# EAGLE design Pickini4 (EAGLE 5.11)
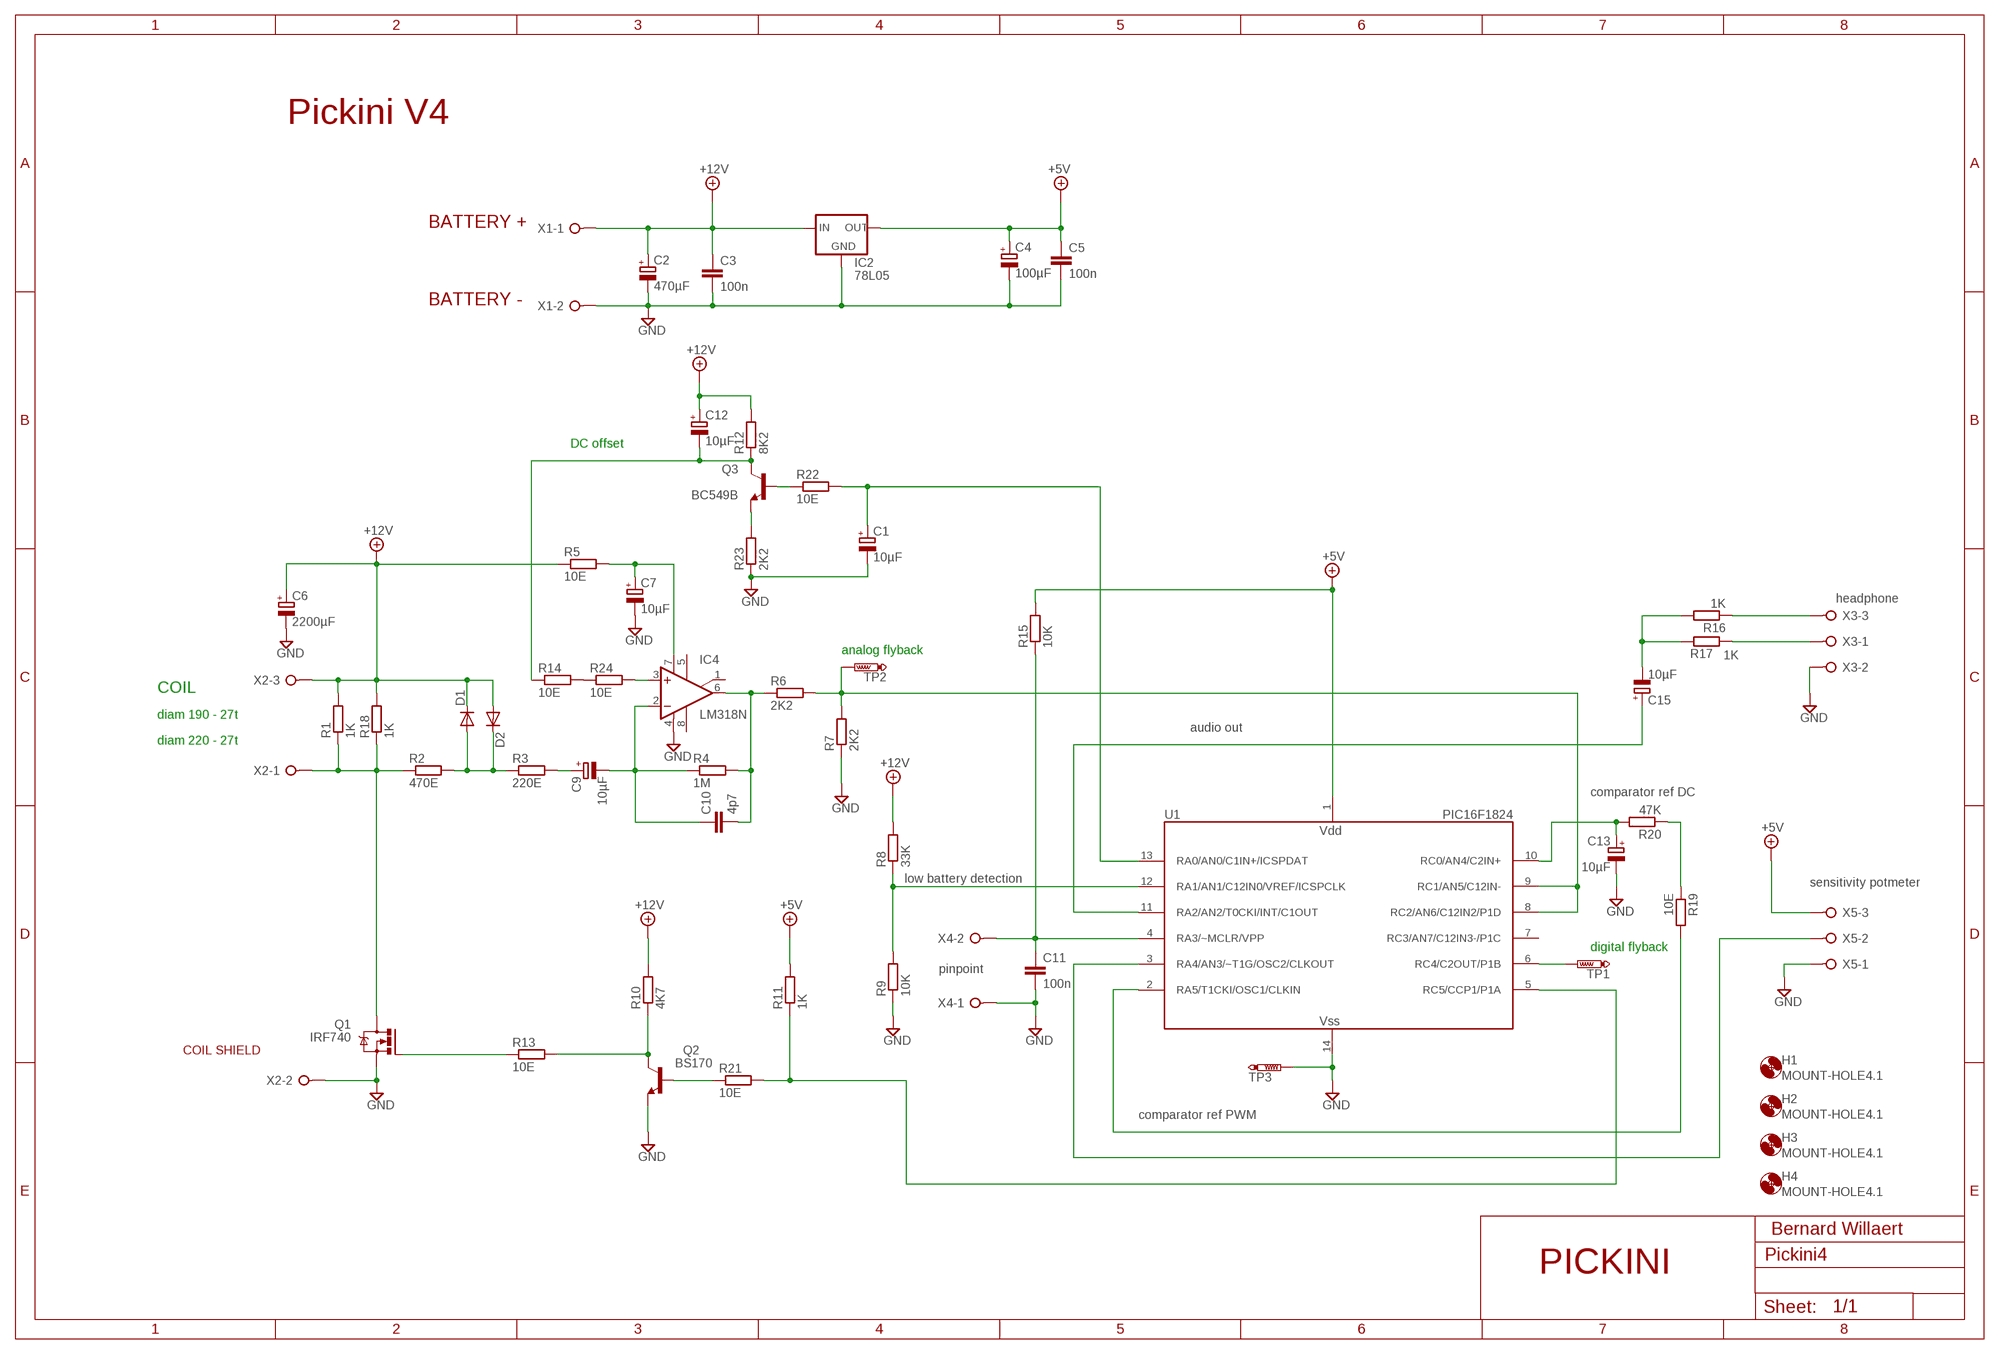
[diagram p0: schematic, sheet 1]

## Parts
C1  10µF  CPOL-EUE5-6  [E5-6]
C2  470µF  CPOL-EUE5-6  [E5-6]
C3  100n  C-EU050-025X075  [C050-025X075]
C4  100µF  CPOL-EUE5-6  [E5-6]
C5  100n  C-EU050-025X075  [C050-025X075]
C6  2200µF  CPOL-EUE7.5-16  [E7,5-16]
C7  10µF  CPOL-EUE5-6  [E5-6]
C9  10µF  CPOL-EUE5-6  [E5-6]
C10  4p7  C-EU050-025X075  [C050-025X075]
C11  100n  C-EU050-025X075  [C050-025X075]
C12  10µF  CPOL-EUE5-6  [E5-6]
C13  10µF  CPOL-EUE5-6  [E5-6]
C15  10µF  CPOL-EUE5-6  [E5-6]
D1  1N4148DO35-7  [DO35-7]
D2  1N4148DO35-7  [DO35-7]
H1  MOUNT-HOLE4.1  [4,1]
H2  MOUNT-HOLE4.1  [4,1]
H3  MOUNT-HOLE4.1  [4,1]
H4  MOUNT-HOLE4.1  [4,1]
IC2  78L05  78LXX  [78LXX]
IC4  LM318N  [DIL08]
Q1  IRF740  [TO220BV]
Q2  BS170  BC549-NPN-TO92-CBE  [TO92-CBE]
Q3  BC549B  [TO92-EBC]
R1  1K  R-EU_0207/10  [0207/10]
R2  470E  R-EU_0207/10  [0207/10]
R3  220E  R-EU_0207/10  [0207/10]
R4  1M  R-EU_0207/10  [0207/10]
R5  10E  R-EU_0207/10  [0207/10]
R6  2K2  R-EU_0207/10  [0207/10]
R7  2K2  R-EU_0207/10  [0207/10]
R8  33K  R-EU_0207/10  [0207/10]
R9  10K  R-EU_0207/10  [0207/10]
R10  4K7  R-EU_0207/10  [0207/10]
R11  1K  R-EU_0207/10  [0207/10]
R12  8K2  R-EU_0207/10  [0207/10]
R13  10E  R-EU_0207/10  [0207/10]
R14  10E  R-EU_0207/10  [0207/10]
R15  10K  R-EU_0207/10  [0207/10]
R16  1K  R-EU_0207/10  [0207/10]
R17  1K  R-EU_0207/10  [0207/10]
R18  1K  R-EU_0207/10  [0207/10]
R19  10E  R-EU_0207/10  [0207/10]
R20  47K  R-EU_0207/10  [0207/10]
R21  10E  R-EU_0207/10  [0207/10]
R22  10E  R-EU_0207/10  [0207/10]
R23  2K2  R-EU_0207/10  [0207/10]
R24  10E  R-EU_0207/10  [0207/10]
TP1  PTR1PAD1-17  [P1-17]
TP2  PTR1PAD1-17  [P1-17]
TP3  PTR1PAD1-17  [P1-17]
U1  PIC16F1824  PIC16616P  [DIP-14]
X1  W237-02P  [W237-132]
X2  W237-3E  [W237-3E]
X3  W237-3E  [W237-3E]
X4  W237-02P  [W237-132]
X5  W237-3E  [W237-3E]

## Nets
+5V: C4.+ C5.1 IC2.OUT R11.2 R15.2 U1.1(VDD) X5.3
+12V: C2.+ C3.1 C6.+ C12.+ D1.C D2.A IC2.IN R1.2 R5.1 R8.2 R10.2 R12.2 R18.2 X1.1 X2.3
DCOFFSET: C12.- Q3.C R12.1 R14.1
GND: C1.- C2.- C3.2 C4.- C5.2 C6.- C7.- C11.2 C13.- IC2.GND IC4.4(V-) Q1.S Q2.E R7.1 R9.1 R23.1 TP3.TP U1.14(VSS) X1.2 X2.2 X3.2 X4.1 X5.1
N$1: R14.2 R24.1
N$2: C10.2 IC4.6(OUT) R4.2 R6.1
N$3: C9.- C10.1 IC4.2(-IN) R4.1
N$4: U1.3(RA4/AN3/~T1G/OSC2/CLKOUT) X5.2
N$5: Q1.D R1.1 R2.1 R18.1 X2.1
N$6: C15.- R16.2 R17.2
N$7: C13.+ R20.2 U1.10(RC0/AN4/C2IN+)
N$8: R16.1 X3.3
N$9: R17.1 X3.1
N$10: C11.1 R15.1 U1.4(RA3/~MCLR/VPP) X4.2
N$11: C15.+ U1.11(RA2/AN2/T0CKI/INT/C1OUT)
N$12: Q1.G R13.1
N$13: R6.2 R7.2 TP2.TP U1.8(RC2/AN6/C12IN2/P1D) U1.9(RC1/AN5/C12IN-)
N$14: Q3.B R22.1
N$15: D1.A D2.C R2.2 R3.1
N$16: R19.1 R20.1
N$17: R8.1 R9.2 U1.12(RA1/AN1/C12IN0/VREF/ICSPCLK)
N$18: C7.+ IC4.7(V+) R5.2
N$19: C9.+ R3.2
N$20: R11.1 R21.2 U1.5(RC5/CCP1/P1A)
N$21: C1.+ R22.2 U1.13(RA0/AN0/C1IN+/ICSPDAT)
N$22: TP1.TP U1.6(RC4/C2OUT/P1B)
N$23: Q2.C R10.1 R13.2
N$24: Q2.B R21.1
N$25: Q3.E R23.2
N$26: IC4.3(+IN) R24.2
N$27: R19.2 U1.2(RA5/T1CKI/OSC1/CLKIN)
Unconnected: IC4.1(ON/CMP) IC4.5(ON) IC4.8(CMP) U1.7(RC3/AN7/C12IN3-/P1C)

## Notes on the sheet
- Pickini V4
- BATTERY +
- BATTERY -
- DC offset
- headphone
- analog flyback
- COIL
- diam 190 - 27t
- audio out
- diam 220 - 27t
- comparator ref DC
- low battery detection
- sensitivity potmeter
- digital flyback
- pinpoint
- COIL SHIELD
- comparator ref PWM
- Bernard Willaert
- PICKINI

## Library data of the parts
C1 C2 C4 C6 C7 C9 C12 C13 C15 = rcl:CPOL-EU: POLARIZED CAPACITOR, European symbol
C3 C5 C10 C11 = rcl:C-EU: CAPACITOR, European symbol
D1 D2 = diode:1N4148: DIODE high speed (Philips)
H1-H4 = holes:MOUNT-HOLE: MOUNTING HOLE with drill center marker
IC2 = v-reg:78LXX: VOLTAGE REGULATOR
IC4 = linear:LM318: OP AMP
Q1 = transistor-power:IRF740: N-CHANNEL MOS FET
Q2 = transistor:*-NPN-: NPN Transistror BF959 corrected 2008.03.06
Q3 = transistor-npn:BC549*: NPN Transistor
R1-R24 = rcl:R-EU_: RESISTOR, European symbol
TP1-TP3 = testpad:PTR1: TEST PIN
U1 = microchip2:PIC16*616: Microchip PIC16F616 and PIC16HV616 14-pin 8-bit Flash microcontroller 2048 words program memory, 128 bytes RAM 11 I/O, 8 10-bit A/D, 2 comparators, 2 8-bit timers, 1 16-bit timer High-voltage variant (HV) available
X1 X4 = con-wago-508:W237-02P: WAGO SREW CLAMP; OC_FARNELL: unknown; OC_NEWARK: unknown
X2 X3 X5 = con-wago-508:W237-3E: WAGO SREW CLAMP; OC_FARNELL: unknown; OC_NEWARK: unknown

## Board
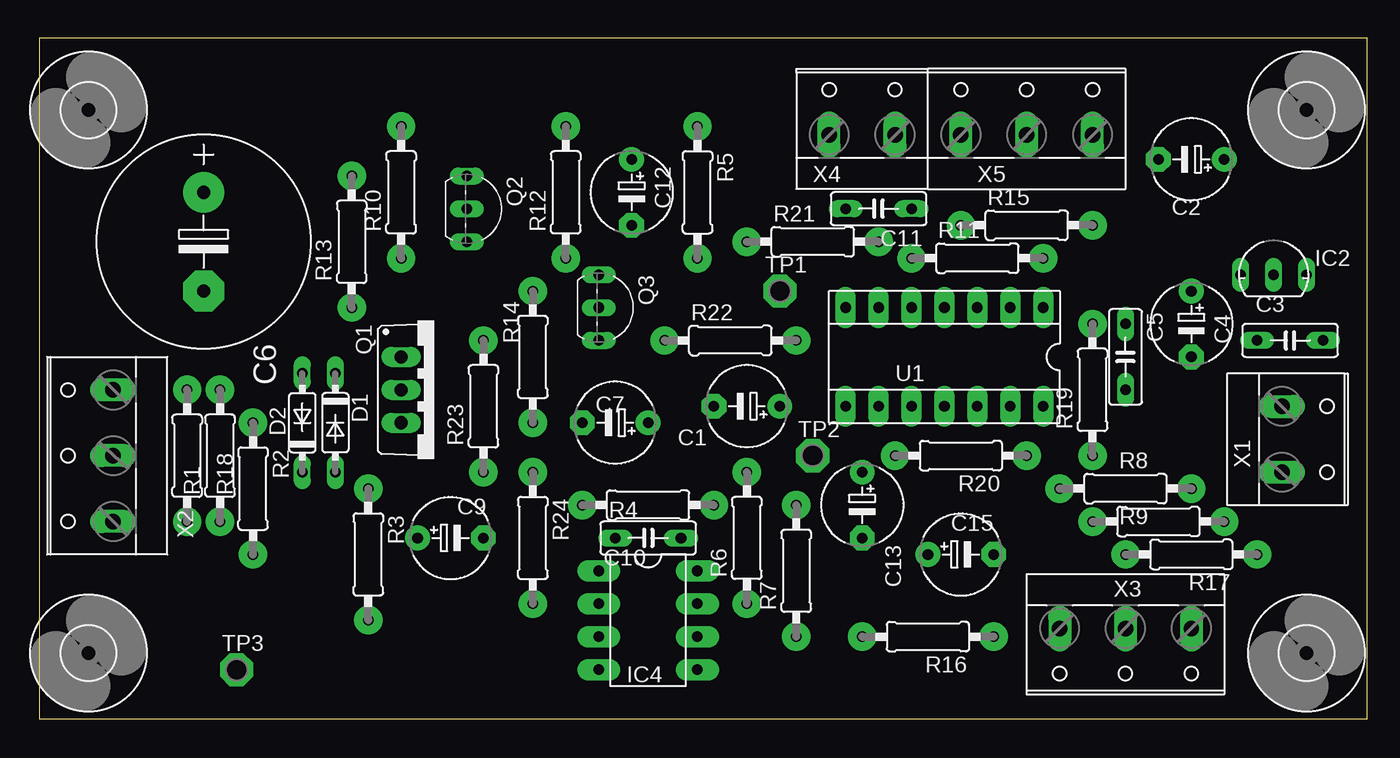
[diagram p1: board, top side]
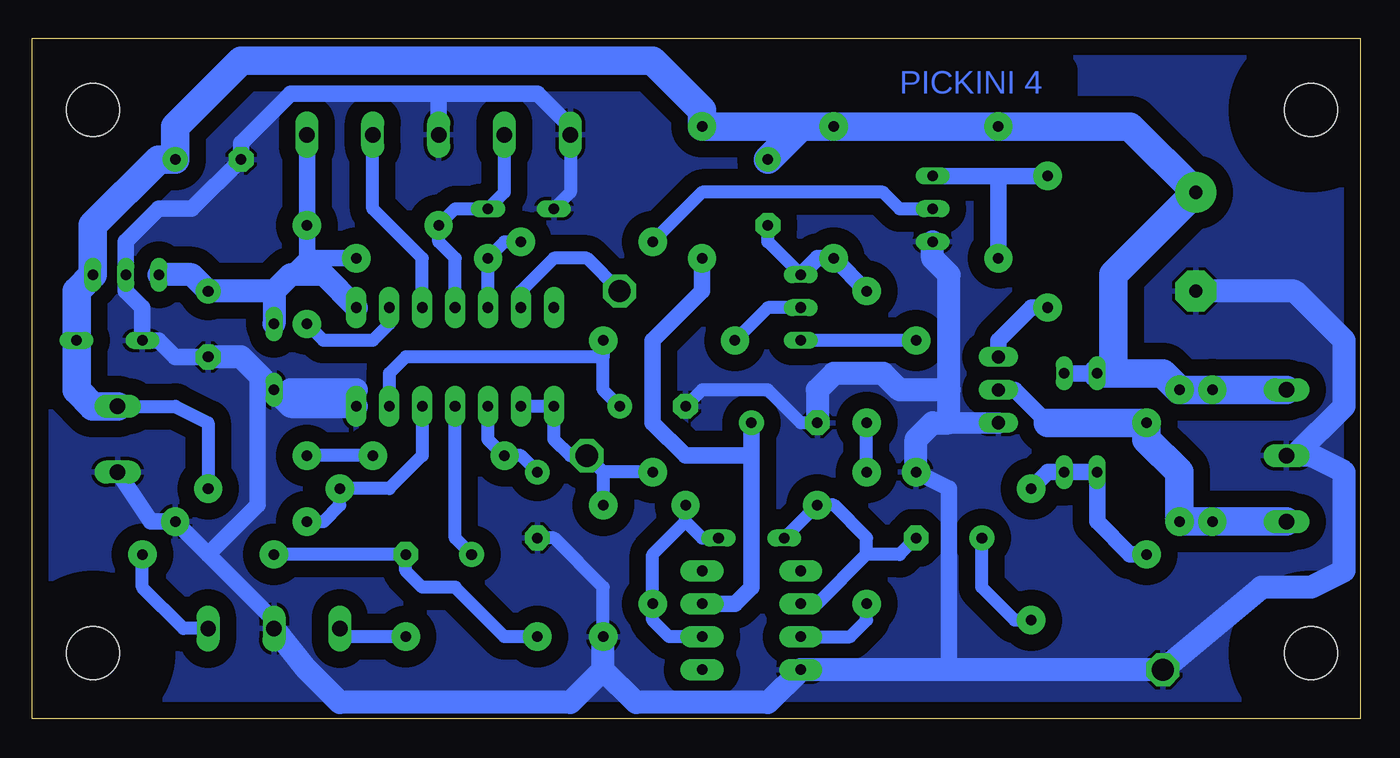
[diagram p2: board, bottom side, seen from below]

Size 102.46 x 52.54 mm. Coordinates in mm from the lower left corner, seen from the top.
Outline: 0,0 102.46,0 102.46,52.54 0,52.54 0,0
Copper layers (1*16): Top 0.035mm / dielectric 1.5mm / Bottom 0.035mm
Design rules "default": minimum track width 10mil, minimum drill 24mil, track to track 8mil, track to pad 8mil, pad to pad 8mil, via to via 8mil, smd to smd 8mil, copper to edge 40mil, drill to drill 8mil, minimum pad ring 10mil, minimum via ring 8mil, stop-mask expansion 4mil, vias tented up to drill 0mil, thermal gap 10mil

### Footprints (pad centres in the part's own frame; a part is rotated, then mirrored left to right if it is on the bottom)
E5-6 = drill 0.813 pad 1.905 round: + -2.54,0 | drill 0.813 pad 1.905 octagon: - 2.54,0
C050-025X075 = drill 0.813 long: 1 -2.54,0; 2 2.54,0
E7,5-16 = drill 1.016 pad 3.15 round: + -3.81,0 | drill 1.016 pad 3.15 octagon: - 3.81,0
DO35-7 = drill 0.813 long: A 3.81,0; C -3.81,0
4,1 = hole 4.1: 0,0
78LXX = drill 0.8 pad 1.27 long: GND 0,0; IN 2.54,0; OUT -2.54,0
DIL08 = drill 0.813 pad 1.676 long: 1 -3.81,-3.81; 2 -1.27,-3.81; 3 1.27,-3.81; 4 3.81,-3.81; 5 3.81,3.81; 6 1.27,3.81; 7 -1.27,3.81; 8 -3.81,3.81
TO220BV = drill 1.016 long: D 0,-2.54; G -2.54,-2.54; S 2.54,-2.54
TO92-CBE = drill 0.813 long: B 0,0; C -2.54,0; E 2.54,0
TO92-EBC = drill 0.813 long: B 0,-1.27; C -2.54,-1.27; E 2.54,-1.27
0207/10 = drill 0.813 pad 2.184 round: 1 -5.08,0; 2 5.08,0
P1-17 = drill 1.702 pad 2.54 octagon: TP 0,0
DIP-14 = drill 0.813 pad 1.6 long: 1 -3.81,7.62; 2 -3.81,5.08; 3 -3.81,2.54; 4 -3.81,0; 5 -3.81,-2.54; 6 -3.81,-5.08; 7 -3.81,-7.62; 8 3.81,-7.62; 9 3.81,-5.08; 10 3.81,-2.54; 11 3.81,0; 12 3.81,2.54; 13 3.81,5.08; 14 3.81,7.62
W237-132 = drill 1.194 long: 1 -2.54,-0.635; 2 2.54,-0.635
W237-3E = drill 1.194 long: 1 -5.08,-0.635; 2 0,-0.635; 3 5.08,-0.635

### Placement (x,y rotation side)
C1  54.61,24.13 180 top
C2  88.9,43.18 180 top
C3  96.52,29.21 180 top
C4  88.9,30.48 270 top
C5  83.82,27.94 270 top
C6  12.7,36.83 270 top
C7  44.45,22.86 180 top
C9  31.75,13.97 0 top
C10  46.99,13.97 0 top
C11  64.77,39.37 180 top
C12  45.72,40.64 270 top
C13  63.5,16.51 270 top
C15  71.12,12.7 0 top
D1  22.86,22.86 270 top
D2  20.32,22.86 90 top
H1  3.81,5.08 0 top
H2  3.81,46.99 0 top
H3  97.79,46.99 0 top
H4  97.79,5.08 0 top
IC2  95.25,34.29 0 top
IC4  46.99,7.62 270 top
Q1  30.48,25.4 270 top
Q2  33.02,39.37 270 top
Q3  44.45,31.75 270 top
R1  11.43,20.32 90 top
R2  16.51,17.78 270 top
R3  25.4,12.7 270 top
R4  46.99,16.51 0 top
R5  50.8,40.64 270 top
R6  54.61,13.97 90 top
R7  58.42,11.43 90 top
R8  83.82,17.78 0 top
R9  86.36,15.24 180 top
R10  27.94,40.64 90 top
R11  72.39,35.56 0 top
R12  40.64,40.64 90 top
R13  24.13,36.83 90 top
R14  38.1,27.94 270 top
R15  76.2,38.1 0 top
R16  68.58,6.35 180 top
R17  88.9,12.7 180 top
R18  13.97,20.32 90 top
R19  81.28,25.4 90 top
R20  71.12,20.32 180 top
R21  59.69,36.83 0 top
R22  53.34,29.21 0 top
R23  34.29,24.13 90 top
R24  38.1,13.97 270 top
TP1  57.15,33.02 0 top
TP2  59.69,20.32 0 top
TP3  15.24,3.81 0 top
U1  69.85,27.94 270 top
X1  96.52,21.59 270 top
X2  5.08,20.32 90 top
X3  83.82,6.35 180 top
X4  63.5,45.72 0 top
X5  76.2,45.72 0 top

### Tracks (layer width: path | path; a pad name or v marks a point on that pad's centre or on a via)
+5V
  Bottom 1.27: 82.55,34.29 81.28,35.56 | 81.28,35.56 R11.2 | 81.28,35.56 R15.2 X5.3
  Bottom 1.778: 83.82,33.02 C5.1 | 83.82,33.02 82.55,34.29 80.01,34.29 U1.1 | 83.82,33.02 C4.+ 90.17,34.29 IC2.OUT
+12V
  Bottom 1.016: R8.2 88.9,22.86 91.44,24.13 X1.1
  Bottom 1.27: D2.A D1.C
  Bottom 2.184: X2.3 R1.2 R18.2 15.24,26.67 19.05,26.67 | 43.18,45.72 R12.2 R10.2 17.78,45.72 C6.+ 19.05,34.29 19.05,26.67 | 19.05,26.67 D2.A | X1.1 97.79,24.13 99.06,25.4 C3.1 99.06,33.02 IC2.IN 97.79,38.1 92.71,43.18 C2.+ 91.44,45.72 86.36,50.8 54.61,50.8 50.8,46.99 R5.1 43.18,45.72 | 43.18,45.72 C12.+
DCOFFSET
  Bottom 1.016: C12.- 45.72,36.83 Q3.C
  Bottom 1.27: R14.1 R12.1 41.91,35.56 Q3.C
GND
  Bottom 0.406: 5.08,20.32 X2.2 | X3.2 83.82,7.62
  Bottom 1.016: R7.1 58.42,10.16 62.23,13.97 C13.- | C1.- 50.8,25.4 45.72,25.4 43.18,22.86 C7.- | C11.2 60.96,40.64 X4.1
  Bottom 1.27: X1.2 93.34,15.24 R9.1 88.9,12.7 | R23.1 31.75,17.78 31.75,3.81 | X4.1 60.96,45.72 63.5,48.26 71.12,48.26 | 71.12,48.26 82.55,48.26 86.36,44.45 C2.- 90.17,39.37 92.71,39.37 95.25,36.83 IC2.GND 95.25,33.02 93.98,31.75 C3.2 92.71,29.21 91.44,27.94 C4.- | 71.12,48.26 X5.1 | 83.82,7.62 88.9,12.7 | 88.9,12.7 85.09,16.51 85.09,26.67
  Bottom 1.676: 31.75,22.86 Q1.S
  Bottom 1.778: 58.42,3.81 55.88,1.27 45.72,1.27 IC4.4 31.75,3.81 TP3.TP 7.62,10.16 3.81,10.16 1.27,11.43 1.27,19.05 3.81,20.32 5.08,20.32 1.27,24.13 1.27,29.21 5.08,33.02 C6.- | 58.42,3.81 R7.1 | 58.42,3.81 60.96,1.27 78.74,1.27 81.28,3.81 X3.2 | 31.75,25.4 31.75,22.86 33.02,22.86 34.29,21.59 R23.1 | 31.75,25.4 31.75,34.29 33.02,35.56 Q2.E | C4.- 86.36,27.94 85.09,26.67 C5.2 82.55,24.13 U1.14 | C7.- 41.91,25.4 40.64,26.67 36.83,26.67 35.56,25.4 31.75,25.4 | 77.47,25.4 82.55,25.4
  pour Bottom (isolate 1.27): 0,52.07 102.87,52.07 102.87,0 0,0
N$1
  Bottom 1.016: R24.1 R14.2
N$2
  Bottom 1.016: 52.07,15.24 R4.2 | 52.07,15.24 54.61,12.7 R6.1 54.61,7.62 53.34,6.35 IC4.6 | C10.2 50.8,13.97 52.07,15.24
N$3
  Bottom 1.016: IC4.2 41.91,8.89 38.1,12.7 | 38.1,12.7 35.56,12.7 C9.- | 38.1,12.7 38.1,13.97 40.64,16.51 R4.1 C10.1
N$4
  Bottom 1.016: U1.3 72.39,35.56 76.2,39.37 X5.2
N$5
  Bottom 1.27: 24.13,22.86 26.67,25.4 Q1.D
  Bottom 2.184: 24.13,22.86 R2.1 16.51,21.59 13.97,19.05 R18.1 R1.1 X2.1
N$6
  Bottom 1.016: R17.2 C15.- 73.66,11.43 72.39,10.16 69.85,10.16 66.04,6.35 R16.2
N$7
  Bottom 1.016: C13.+ 64.77,20.32 R20.2 67.31,21.59 U1.10
N$8
  Bottom 1.016: R16.1 78.11,6.35 X3.3
N$9
  Bottom 1.016: X3.1 90.81,6.99 93.98,10.16 R17.1
N$10
  Bottom 1.016: U1.4 69.85,35.56 71.12,36.83 R15.1 69.85,39.37 C11.1 66.04,40.64 X4.2
N$11
  Bottom 1.016: C15.+ 69.85,13.97 U1.11
N$12
  Bottom 1.27: R13.1 25.4,31.75 27.94,29.21 Q1.G
N$13
  Bottom 1.016: 58.42,19.05 R7.2 | 58.42,19.05 TP2.TP 60.96,20.32 62.23,21.59 U1.8 U1.9 | R6.2 58.42,19.05
N$14
  Bottom 1.016: Q3.B 45.72,31.75 R22.1
N$15
  Bottom 1.27: R2.2 17.78,12.7 20.32,15.24 D2.C D1.A 24.13,19.05 R3.1
N$16
  Bottom 1.016: R20.1 R19.1
N$17
  Bottom 1.016: U1.12 72.39,20.32 74.93,17.78 R8.1 78.74,16.51 80.01,15.24 R9.2
N$18
  Bottom 1.27: 46.99,20.32 C7.+ | 46.99,20.32 52.07,20.32 54.61,22.86 54.61,29.21 50.8,33.02 R5.2 | 46.99,20.32 46.99,10.16 48.26,8.89 IC4.7
N$19
  Bottom 1.016: R3.2 26.67,7.62 29.21,10.16 C9.+
N$20
  Bottom 1.016: U1.5 R11.1 66.04,36.83 R21.2
N$21
  Bottom 1.016: U1.13 74.93,26.67 73.66,27.94 58.42,27.94 | R22.2 58.42,27.94 | C1.+ 58.42,25.4 58.42,27.94
N$22
  Bottom 1.016: TP1.TP 59.69,35.56 62.23,35.56 64.77,33.02 U1.6
N$23
  Bottom 1.27: R13.2 27.94,41.91 | 27.94,41.91 Q2.C | 27.94,41.91 R10.1
N$24
  Bottom 1.016: R21.1 50.8,40.64 36.83,40.64 35.56,39.37 Q2.B
N$25
  Bottom 1.016: R23.2 Q3.E
N$26
  Bottom 1.016: IC4.3 39.37,6.35 38.1,7.62 R24.2
N$27
  Bottom 1.016: U1.2 74.93,30.48 76.2,29.21 80.01,29.21 R19.2

### Text on the board
Bottom: PICKINI 4